# EAGLE design powerpuck_mini v4 (EAGLE 9.3.1)
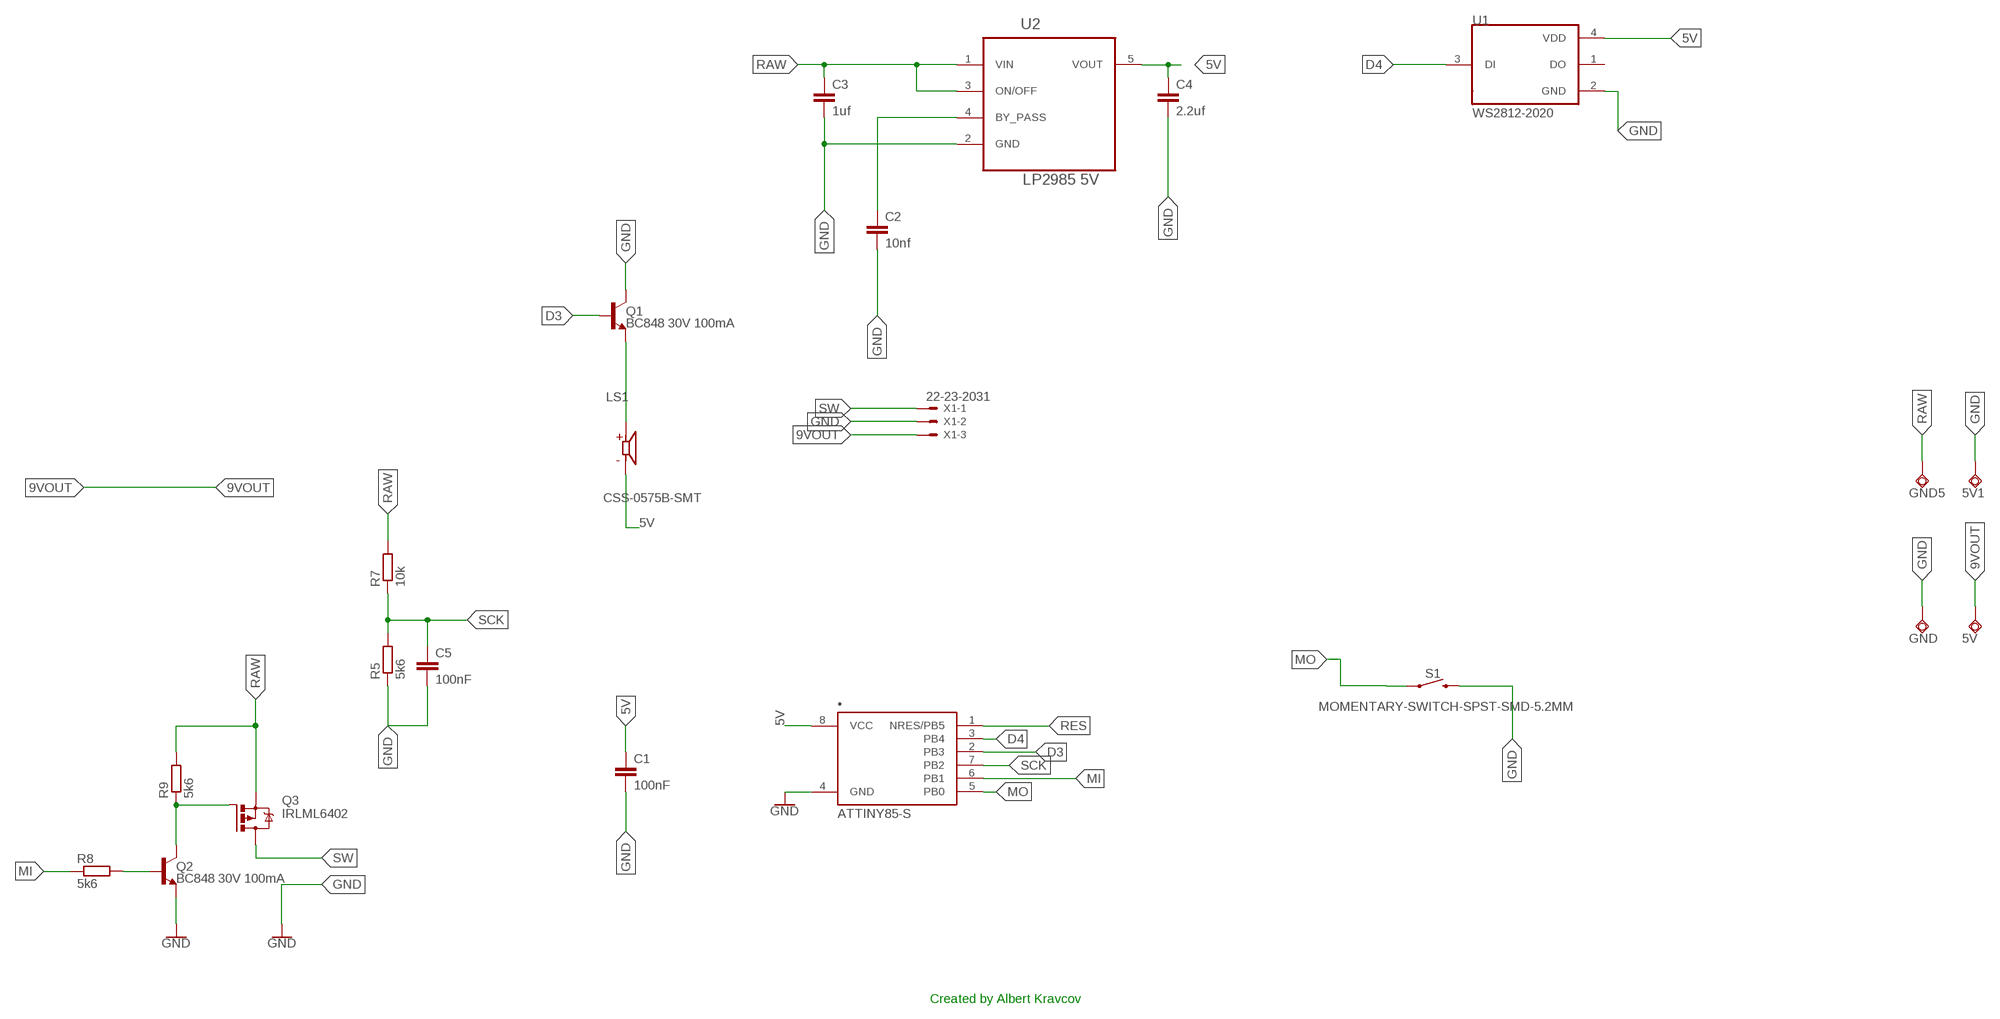
[diagram p0: schematic, sheet 1]

## Parts
5V  TPSQTP20R  [TP20R]
5V1  TPSQTP20R  [TP20R]
C1  100nF  C-EUC0603  [C0603]
C2  10nf  C-EUC0805  [C0805]
C3  1uf  C-EUC0805  [C0805]
C4  2.2uf  C-EUC0805  [C0805]
C5  100nF  C-EUC0603  [C0603]
GND  TPSQTP20R  [TP20R]
GND5  TPSQTP20R  [TP20R]
LS1  CSS-0575B-SMT  [CUI_CSS-0575B-SMT]
Q1  BC848 30V 100mA  TRANS_NPN-MMBT2222AL  [SOT23-3]
Q2  BC848 30V 100mA  TRANS_NPN-MMBT2222AL  [SOT23-3]
Q3  IRLML6402  IRLML5203  [MICRO3]
R5  5k6  R-EU_R0603  [R0603]
R7  10k  R-EU_R0603  [R0603]
R8  5k6  R-EU_R0603  [R0603]
R9  5k6  R-EU_R0603  [R0603]
S1  MOMENTARY-SWITCH-SPST-SMD-5.2MM  [TACTILE_SWITCH_SMD_5.2MM]
U1  WS2812-2020  [LED_WS2812-2020]
U2  LP2985 5V  LP2985AIM5-5.0  [SOT95P284X119-5N]
X1  22-23-2031  [22-23-2031]
•  ATTINY85-S  [SOIC8_EIAJ_208MIL]

## Nets
5V: C1.1 C4.1 LS1.2(N) U1.4(VDD) U2.5(VOUT) •.8(VCC)
9VOUT: 5V.TP X1.3
D3: Q1.1(B) •.2(PB3)
D4: U1.3(DI) •.3(PB4)
GND: 5V1.TP C1.2 C2.2 C3.2 C4.2 C5.2 GND.TP Q1.3(C) Q2.2(E) R5.1 S1.3 U1.2(GND) U2.2(GND) X1.2 •.4(GND)
MI: R8.1 •.6(PB1)
MO: S1.1 •.5(PB0)
N$3: C2.1 U2.4(BY_PASS)
N$4: LS1.1(P) Q1.2(E)
N$11: Q2.1(B) R8.2
N$12: Q2.3(C) Q3.1(G) R9.1
RAW [medium]: C3.1 GND5.TP Q3.2(S) R7.2 R9.2 U2.1(VIN) U2.3(ON/OFF)
RES: •.1(NRES/PB5)
SCK: C5.1 R5.2 R7.1 •.7(PB2)
SW [medium]: Q3.3(D) X1.1
Unconnected: U1.1(DO)

## Notes on the sheet
- Created by Albert Kravcov

## Library data of the parts
5V 5V1 GND GND5 = testpad:TPSQ: Test pad
C1 C5 = resistor:C-EU: CAPACITOR, European symbol
C2-C4 = rcl:C-EU: CAPACITOR, European symbol; SPICEPREFIX: C
LS1 = CSS-0575B-SMT:CSS-0575B-SMT: 5 mm, 3 V, 75 dB, Surface Mount (SMT), Magnetic Audio Transducer Buzzer; AVAILABILITY: Unavailable; CUI_PURCHASE_URL: https://www.cuidevices.com/product/audio/buzzers/audio-transducers/css-0575b-smt-tr?utm_source=snapeda.com&utm_medium=referral&utm_campaign=snapedaBOM; DESCRIPTION: 5 mm, 3 V, 75 dB, Surface Mount _SMT_, Magnetic Audio Transducer Buzzer; MF: CUI Devices; MP: CSS-0575B-SMT-TR; PACKAGE: CUI Inc.; PRICE: None
Q1 Q2 = SparkFun-DiscreteSemi:TRANS_NPN: NPN transistor Current controlled devices typically used to amplify current or used as a switch. BC547 - COM-08928 <http://www.sparkfun.com/products/8928> (TO-92 45V 100mA) (1.Collector 2.Base 3.Emitter) 2N3904 - COM-00521 <http://www.sparkfun.com/products/521> (TO-92 40V 200mA) (1.Emitter 2.Base 3.Collector) P2N2222A - COM-12852 <http://www.sparkfun.com/products/12852> (TO-92 40V 600mA) (1.Collector 2.Base 3.Emitter); PROD_ID: TRANS-08049; VALUE: 600mA/40V
Q3 = transistor-power:IRLML5203: HEXFET P-Channel Power MOSFET
R5 R7-R9 = resistor:R-EU_: RESISTOR, European symbol
S1 = SparkFun-Switches:MOMENTARY-SWITCH-SPST: Momentary Switch (Pushbutton) - SPST Normally-open (NO) SPST momentary switches (buttons, pushbuttons). Variants PTH-12MM - 12mm square, through-hole Momentary Pushbutton Switch - 12mm Square <https://www.sparkfun.com/products/9190> (COM-09190) PTH-6.0MM, PTH-6.0MM-KIT - 6.0mm square, through-hole Mini Pushbutton Switch <https://www.sparkfun.com/products/97> (COM-00097) KIT package intended for soldering kit's - only one side of pads' copper is exposed. PTH-RIGHT-ANGLE-KIT - Right-angle, through-hole Right Angle Tactile Button <https://www.sparkfun.com/products/10791> - Used on SparkFun BigTime Watch Kit <https://www.sparkfun.com/products/11734> SMD-12MM - 12mm square, surface-mount Tactile Button - SMD (12mm) <https://www.sparkfun.com/products/12993> (COM-12993) Used on SparkFun PicoBoard <https://www.sparkfun.com/products/11888> SMD-4.5MM - 4.5mm Square Trackball Switch Used on SparkFun Blackberry Trackballer Breakout <https://www.sparkfun.com/products/13169> SMD-4.6MMX2.8MM - 4.60mm x 2.80mm, surface mount Used on SparkFun SAMD21 Mini Breakout <https://www.sparkfun.com/products/13664> SMD-5.2MM, SMD-5.2-REDUNDANT - 5.2mm square, surface-mount Mini Pushbutton Switch - SMD <https://www.sparkfun.com/products/8720> (COM-08720) Used on Arduino Pro Mini <https://www.sparkfun.com/products/11114> REDUNDANT package connects both switch circuits together SMD-6.0X3.5MM - 6.0 x 3.5mm, surface mount Momentary Reset Switch SMD <https://www.sparkfun.com/products/8229> (COM-08229) SMD-6.2MM-TALL - 6.2mm square, surface mount Tactile Button - SMD (6mm) <https://www.sparkfun.com/products/12992> Used on SparkFun Digital Sandbox <https://www.sparkfun.com/products/12651> SMD-RIGHT-ANGLE - Right-angle, surface mount Used on SparkFun Block for Intel® Edison - Arduino <https://www.sparkfun.com/products/13036>; PROD_ID: SWCH-08247; SF_SKU: COM-08720
U1 = WS2812-2020:WS2812-2020: Intelligent control LED integrated light source; AVAILABILITY: Unavailable; MF: Worldsemi; MP: WS2812-2020; PACKAGE: Package; PRICE: None
U2 = LP2985AIM5-5.0:LP2985AIM5-5.0: Drop out Regulator; AVAILABILITY: Unavailable; DESCRIPTION: Integrated Circuit; MF: National Semiconductor; MP: LP2985AIM550; PACKAGE: None; PRICE: None
X1 = con-molex:22-23-2031: .100" (2.54mm) Center Header - 3 Pin; MF: MOLEX; MPN: 22-23-2031; OC_FARNELL: 1462950; OC_NEWARK: 30C0862
• = _hhn_attiny25_45_85:ATTINY85*: ATMEL ATtiny 85 Packages: P = PDIP 08 30mil S = SOIC 08 EIAJ 208mil Technologies Note: for complete ordering code (temp. range, finish, tape&reel etc.) see www.atmel.com • Supply Voltage: V = (1.8…5.5)V | [blank] = (2.7…5.5)V • Speed: 10 = 10 MHz | 20 = 20 MHz Author: Dipl.-Ing. FH Rainer Bayer HHN Hochschule Heilbronn (Heilbronn University), rainer.bayer@hs-heilbronn.de Ingenieurbüro ing-rb, mail@ing-rb.de

## Net classes
0 default: width 0.2 mm, drill 0.254 mm, clearance 0.22 mm
2 medium: width 0.305 mm, drill 0.3 mm, clearance 0.305 mm

## Board
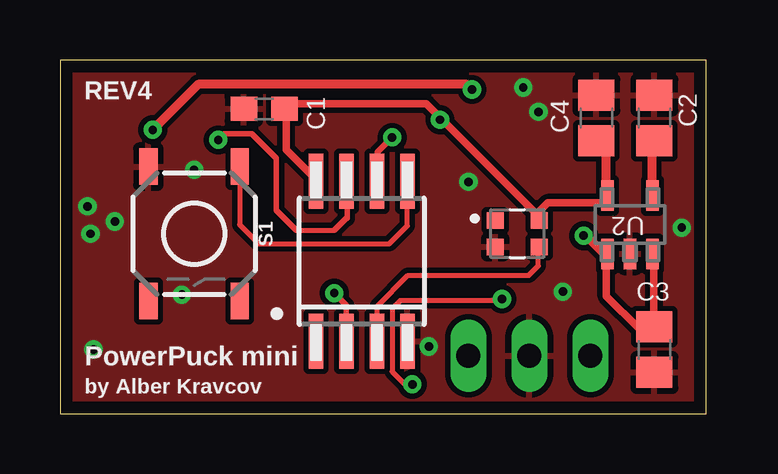
[diagram p1: board, top side]
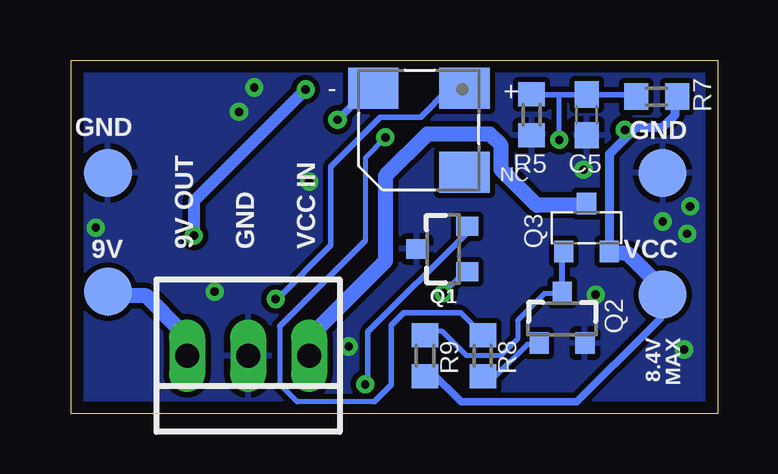
[diagram p2: board, bottom side, seen from below]

Size 26.92 x 14.73 mm. Coordinates in mm from the lower left corner, seen from the top.
Outline: 0,14.73 0,0 26.92,0 26.92,14.73 0,14.73
Copper layers (1*16): Top 0.035mm / dielectric 1.5mm / Bottom 0.035mm
Design rules "default *": minimum track width 6mil, minimum drill 0.35mm, track to track 6mil, track to pad 6mil, pad to pad 6mil, via to via 6mil, smd to smd 6mil, copper to edge 0.5mm, drill to drill 6mil, minimum pad ring 10mil, minimum via ring 8mil, stop-mask expansion 4mil, vias tented up to drill 2mm, thermal gap 10mil

### Footprints (pad centres in the part's own frame; a part is rotated, then mirrored left to right if it is on the bottom)
TP20R = smd 2 x 2: TP 0,0
C0603 = smd 1.1 x 1: 1 -0.85,0; 2 0.85,0
C0805 = smd 1.3 x 1.5: 1 -0.95,0; 2 0.95,0
CUI_CSS-0575B-SMT = smd 2.1 x 1.7: 1 -1.9,-1.75; 2 1.9,-1.75; 3 -1.9,1.75
SOT23-3 = smd 0.8 x 0.9: 1 -0.95,-1; 2 0.95,-1; 3 0,1.1
MICRO3 = smd 0.8 x 0.9: 1 -0.95,-1; 2 0.95,-1; 3 0,1
R0603 = smd 1 x 1.1: 1 -0.85,0; 2 0.85,0
TACTILE_SWITCH_SMD_5.2MM = smd 1.524 x 0.762: 1 -2.794,1.905; 2 2.794,1.905; 3 -2.794,-1.905; 4 2.794,-1.905
LED_WS2812-2020 = smd 0.7 x 0.7: 1 -0.915,0.55; 2 -0.915,-0.55; 3 0.915,-0.55; 4 0.915,0.55
SOT95P284X119-5N = smd 1.27 x 0.533: 1 -1.219,0.94; 2 -1.219,0; 3 -1.219,-0.94; 4 1.219,-0.94; 5 1.219,0.94
22-23-2031 = drill 1 long: 1 -2.54,0; 2 0,0; 3 2.54,0
SOIC8_EIAJ_208MIL = smd 0.6 x 2.286: 1 -1.905,-3.33; 2 -0.635,-3.33; 3 0.635,-3.33; 4 1.905,-3.33; 5 1.905,3.33; 6 0.635,3.33; 7 -0.635,3.33; 8 -1.905,3.33

### Placement (x,y rotation side)
5V  25.4,5.08 0 bottom
5V1  2.29,10.03 0 bottom
C1  8.51,12.7 180 top
C2  24.77,12.32 90 top
C3  24.77,2.67 270 top
C4  22.35,12.32 90 top
C5  5.46,12.45 270 bottom
GND  25.4,10.03 0 bottom
GND5  2.29,4.95 0 bottom
LS1  12.45,11.81 180 bottom
Q1  11.43,6.86 90 bottom
Q2  6.48,3.94 0 bottom
Q3  5.46,7.75 0 bottom
R5  7.75,12.45 90 bottom
R7  2.54,13.21 0 bottom
R8  9.78,2.41 270 bottom
R9  12.19,2.41 270 bottom
S1  5.59,7.49 270 top
U1  19.05,7.49 0 top
U2  23.75,7.87 90 top
X1  19.56,2.41 180 bottom
•  12.57,6.35 0 top

### Tracks (layer width: path | path; a pad name or v marks a point on that pad's centre or on a via)
5V  (via drill 0.35)
  Top 0.2: 22.55,8.78 22.87,9.09 U2.5 22.74,9.16 | 22.74,10.9 22.45,11.19 22.45,11.3 C4.1 | 9.43,12.92 9.43,12.66 C1.1 | 10.69,9.72 •.8 | 19.93,8.25 19.93,8.04 U1.4 | v15.84,12.24 15.89,12.29
  Top 0.305: 22.55,8.78 20.32,8.78 19.96,8.42 U1.4 | 9.43,12.66 9.43,10.98 10.69,9.72 | 19.93,8.25 15.89,12.29 15.26,12.92 9.43,12.92
  Top 0.381: 22.74,10.9 22.74,9.16
  Bottom 0.2: 14.57,13.5 14.37,13.5 LS1.2
  Bottom 0.305: v15.84,12.24 14.57,13.5
9VOUT
  Bottom 0.2: 25.39,5 5V.TP
  Bottom 0.508: 22.34,3.44 22.1,3.2 X1.3
  Bottom 0.635: 22.34,3.44 23.8,4.9 25.39,4.9 25.39,5
D3  (via drill 0.35)
  Top 0.2: •.2
  Top 0.229: v11.43,5.02 11.93,4.51 •.2
  Bottom 0.2: v11.43,5.02 10.54,5.91 Q1.1
D4
  Top 0.2: U1.3 19.93,6.89 19.93,6.15 19.54,5.76 14.5,5.76 13.21,4.47 13.21,3.11 •.3
GND  (via drill 0.35)
  Bottom 0.2: C5.2 5.44,11.61 5.38,11.61
  other vias: 19.94,12.57 1.27,7.49 15.37,2.79 5.59,10.16 5.08,4.95 17.02,9.65 20.96,5.08 19.3,13.59 2.29,8 1.4,2.67 25.91,7.75 1.14,8.64
  pour Top: -0.89,16.38 27.94,16.38 27.94,-7.75 -0.89,-7.75
  pour Bottom: -0.89,15.11 26.67,15.11 26.67,-0.13 -0.89,-0.13
MI  (via drill 0.35)
  Top 0.2: 13.21,9.72 •.6
  Top 0.229: 13.21,9.72 13.21,10.88 v13.84,11.51
  Bottom 0.2: 9.82,3.26 R8.1 | 14.31,0.48 17.52,0.48 18.25,1.22 18.25,3.63 | 14.68,7.2 14.68,10.67 v13.84,11.51
  Bottom 0.229: 14.68,7.2 18.25,3.63 | 14.31,0.48 13.59,1.2 13.59,3.68 13.08,4.19 10.71,4.19 R8.1
MO
  Top 0.2: S1.1 7.49,7.87 8.29,7.07 13.72,7.07 14.47,7.82 14.47,9.62 •.5
N$3
  Top 0.2: 24.66,11.19 24.76,11.3 C2.1 | 24.66,9.2 U2.4
  Top 0.381: 24.66,11.19 24.66,9.2
N$4  (via drill 0.35)
  Top 0.2: v14.68,1.22 14.37,1.22 13.84,1.74 13.84,4.37 14.18,4.7 18.35,4.7 v18.42,4.77
  Bottom 0.2: 10.48,7.5 10.48,7.73 Q1.2 | v14.68,1.22 14.57,1.32 | 11.21,13.5 10.59,13.5 LS1.1
  Bottom 0.229: 10.48,7.5 14.57,3.4 14.57,1.32 | v18.42,4.77 18.35,4.77 16.12,7.01 16.12,10.28 14.05,12.35 12.37,12.35 11.21,13.5
N$11
  Bottom 0.2: R8.2 9.77,1.55 9.26,1.55 7.92,2.9 7.43,2.9 Q2.1
N$12
  Bottom 0.2: 6.49,5.1 Q2.3 6.49,5 7.23,5 8.34,3.89 8.34,3.11 9.03,2.41 10.46,2.41 11.47,3.42 12.14,3.42 R9.1 | 6.49,6.68 Q3.1
  Bottom 0.254: 6.49,6.68 6.49,5.1
RAW  (via drill 0.35)
  Top 0.305: U2.3 24.74,6.6 24.74,3.64 C3.1 24.76,3.53 24.13,3.53 22.77,4.89 22.77,6.57 U2.1 22.66,6.68 | v21.82,7.41 21.93,7.41
  Top 0.381: 21.93,7.41 22.66,6.68 | v17.17,13.5 16.96,13.71 5.75,13.71 v3.87,11.82
  Bottom 0.305: 2.29,5.21 2.29,5 GND5.TP 2.39,4.89 2.39,3.94 2.79,3.55 5.86,0.48 10.69,0.48 11.95,1.74 12.11,1.74 R9.2 | 4.5,6.68 Q3.2 4.5,6.89 | 1.76,13.19 R7.2
  Bottom 0.381: 1.76,13.19 1.76,12.45 2.29,11.93 3.38,11.93 3.68,11.63 | 3.68,11.63 4.5,10.82 4.5,6.89 | 3.68,11.63 v3.87,11.82
  Bottom 0.508: v21.82,7.41 21.82,8.85 v17.17,13.5
  Bottom 0.635: 4.5,6.68 3.76,6.68 2.29,5.21
SCK  (via drill 0.35)
  Top 0.2: 11.96,9.77 •.7 | 9.85,7.63 11.43,7.63 | 11.93,8.13 11.96,8.13
  Top 0.229: 11.96,8.13 11.96,9.77 | v6.59,11.4 6.85,11.66 7.99,11.66 9.01,10.64 9.01,8.47 9.85,7.63 | 11.43,7.63 11.93,8.13
  Bottom 0.2: 3.45,13.29 R7.1 | 5.44,13.29 C5.1 5.55,13.29 | 7.65,13.29 R5.2 | v6.59,11.4 6.59,13.29
  Bottom 0.229: 5.44,13.29 3.45,13.29 | 5.55,13.29 6.59,13.29 7.65,13.29
SW
  Bottom 0.305: Q3.3 5.55,8.67
  Bottom 0.508: 17.02,3.17 X1.1
  Bottom 0.635: 17.02,3.17 13.84,6.35 13.84,9.91 12.11,11.64 9.48,11.64 9.02,11.18 9.02,10.16 7.53,8.67 5.55,8.67

### Text on the board
tNames: REV4 | PowerPuck mini | by Alber Kravcov
bNames: GND | GND | VCC | VCC IN | GND | 9V OUT | 9V | 8.4V / MAX